# EAGLE design robot (EAGLE 6.4)
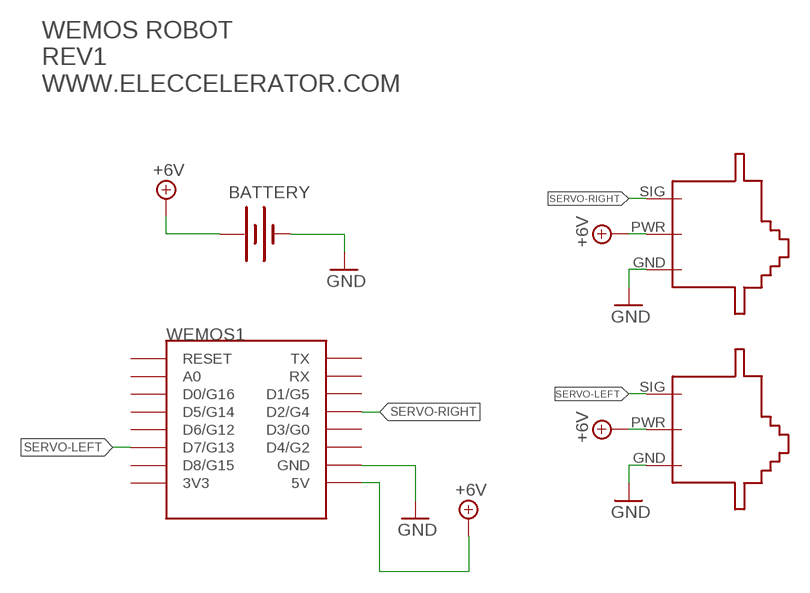
[diagram p0: schematic, sheet 1]

## Parts
BATTERY  BATTERY-WIRE-CONN  [BATT-WIRE-CONN]
M1  SERVO-FLIPPED  [SERVO-FLIPPED]
M2  SERVO-1  [SERVO]
U$1  HACKADAY-14MM  [HACKADAY-1]
U$9  TEXT-INFO-MINI  [TEXT-INFO-MINI]
WEMOS1  WEMOS-D1-MINI  [WEMOS-D1-MINI]

## Nets
+6V: BATTERY.POS(+) M1.PWR M2.PWR WEMOS1.5V
GND: BATTERY.NEG(-) M1.GND M2.GND WEMOS1.GND
SERVO-LEFT: M1.SIG WEMOS1.D7(D7/G13)
SERVO-RIGHT: M2.SIG WEMOS1.D2(D2/G4)
Unconnected: WEMOS1.3V3 WEMOS1.A0 WEMOS1.D0(D0/G16) WEMOS1.D1(D1/G5) WEMOS1.D3(D3/G0) WEMOS1.D4(D4/G2) WEMOS1.D5(D5/G14) WEMOS1.D6(D6/G12) WEMOS1.D8(D8/G15) WEMOS1.RESET WEMOS1.RX WEMOS1.TX

## Library data of the parts
BATTERY = robot:BATTERY: Battery Holders Various common sizes : AA, AAA, 20mm coin cell and 12mm coin cell.
M1 M2 = robot:SERVO
U$1 = robot:HACKADAY
U$9 = robot:TEXT-INFO
WEMOS1 = robot:WEMOS-D1-MINI: WeMos.cc D1 mini ESP8266 module

## Board
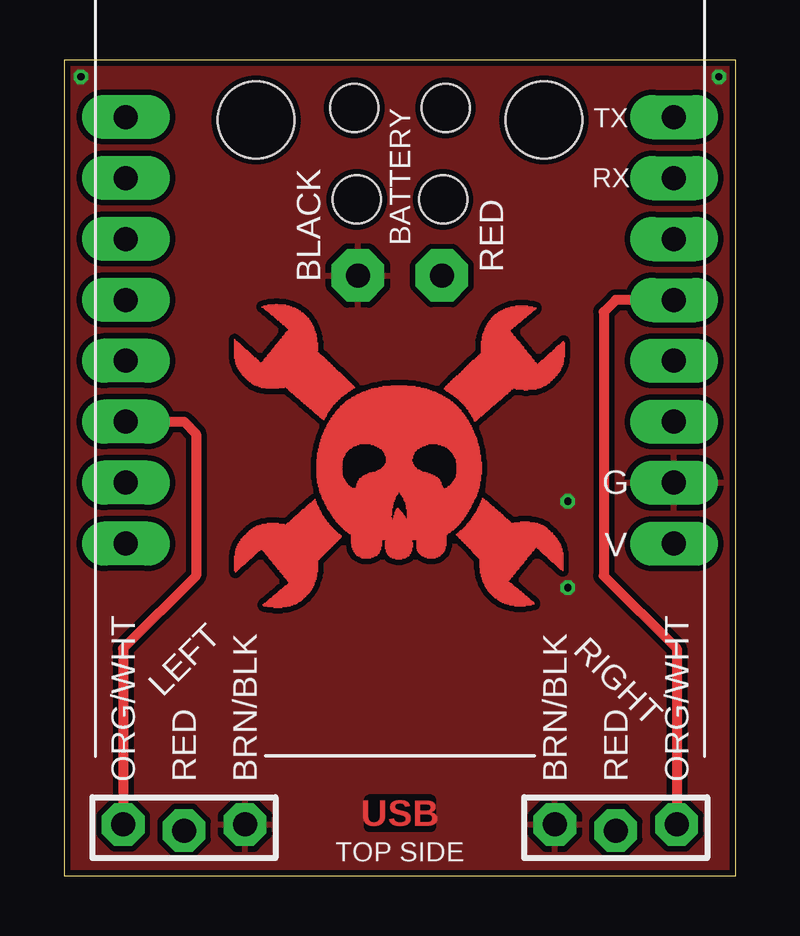
[diagram p1: board, top side]
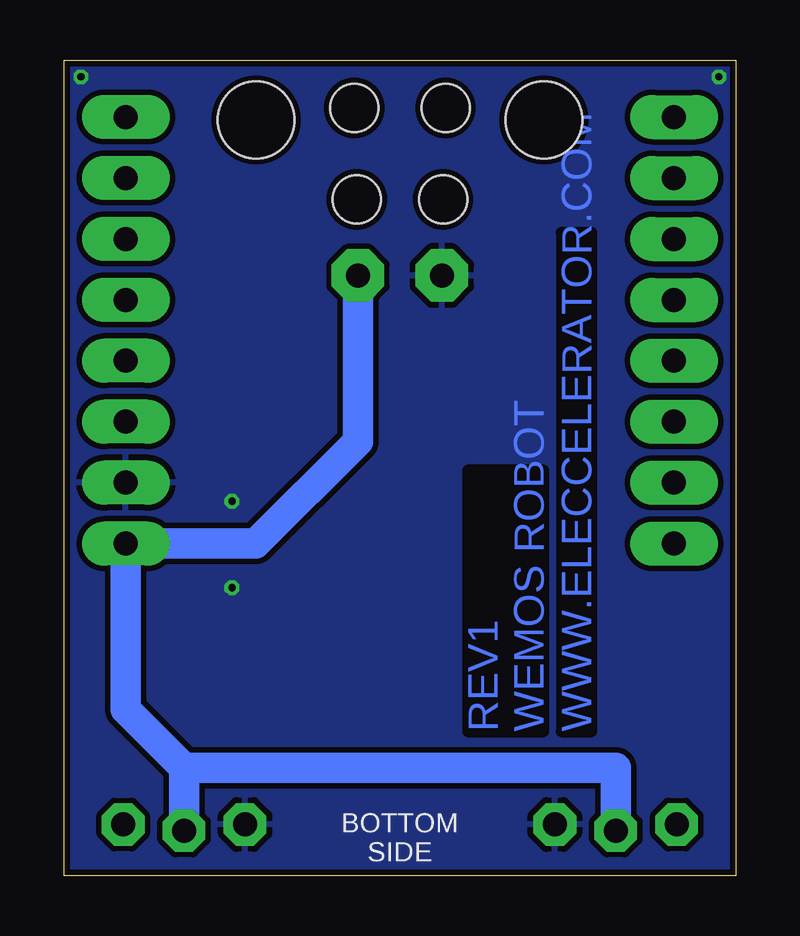
[diagram p2: board, bottom side, seen from below]

Size 28 x 34 mm. Coordinates in mm from the lower left corner, seen from the top.
Outline: 0,0 28,0 28,34 0,34 0,0
Copper layers (1*16): Top 0.035mm / dielectric 1.5mm / Bottom 0.035mm
Design rules "Fusion_eagle_rule_v1.1_TentedVias3": minimum track width 6mil, minimum drill 0.3mm, track to track 7mil, track to pad 7mil, pad to pad 7mil, via to via 7mil, smd to smd 0mil, copper to edge 10mil, drill to drill 10mil, minimum pad ring 10mil, minimum via ring 6mil, stop-mask expansion 2mil, vias tented up to drill 25mil, thermal gap 10mil
Holes 3.2 mm at 8,31.5 20,31.5

### Footprints (pad centres in the part's own frame; a part is rotated, then mirrored left to right if it is on the bottom)
BATT-WIRE-CONN = drill 1 pad 2.184 octagon: NEG -6.985,-1.75; POS -6.985,1.75 | hole 2: 0,1.905; 0,-1.905; -3.81,1.8; -3.81,-1.8
SERVO-FLIPPED = drill 1 pad 1.778 octagon: GND 2.54,0.127; PWR 0,-0.127; SIG -2.54,0.127
SERVO = drill 1 pad 1.778 octagon: GND -2.54,0.127; PWR 0,-0.127; SIG 2.54,0.127
WEMOS-D1-MINI = drill 1 pad 1.829 long: 3V3 -11.43,-10.16; 5V 11.43,-10.16; A0 -11.43,5.08; D0 -11.43,2.54; D1 11.43,2.54; D2 11.43,0; D3 11.43,-2.54; D4 11.43,-5.08; D5 -11.43,0; D6 -11.43,-2.54; D7 -11.43,-5.08; D8 -11.43,-7.62; GND 11.43,-7.62; RESET -11.43,7.62; RX 11.43,5.08; TX 11.43,7.62

### Placement (x,y rotation side)
BATTERY  14,32 90 bottom
M1  5,2 0 top
M2  23,2 0 top
U$1  7,11 0 top
U$9  8,6 90 bottom
WEMOS1  14,24 0 top

### Tracks (layer width: path | path; a pad name or v marks a point on that pad's centre or on a via)
+6V
  Bottom 1.27: M1.PWR 5,4.5 23,4.5 | 23,4.5 M2.PWR | 23,4.5 25.43,6.93 WEMOS1.5V 20.01,13.84 15.75,18.1 BATTERY.POS
GND  (via drill 0.3)
  other vias: 27.3,33.3 0.7,33.3 21,15.6 21,12
  pour Bottom (isolate 0.23): 0,0 28,0 28.05,34 0,34
  pour Top (isolate 0.23): 0,0 28,0 28.05,34 0,34
SERVO-LEFT
  Top 0.406: WEMOS1.D7 4.99,18.92 5.5,18.41 5.5,12.5 2.46,9.46 M1.SIG
SERVO-RIGHT
  Top 0.406: WEMOS1.D2 23,24 22.5,23.5 22.5,12.5 25.54,9.46 M2.SIG

### Text on the board
Top: USB
Bottom: WWW.ELECCELERATOR.COM
tPlace: TX | RX | G | V | LEFT | RIGHT | TOP SIDE
bPlace: BOTTOM / SIDE
tStop: USB
bStop: WWW.ELECCELERATOR.COM